# EasyEDA Pro project RESPi.epro

# Schematic Schematic1
Board Name: Board1; Create Date: 2025-11-06; Page Name: P1; Project Name: RESPi; Schematic Name: Schematic1; Update Date: 2025-11-08; Company: EasyEDA.com; Page Size: A4; Version: V1.0
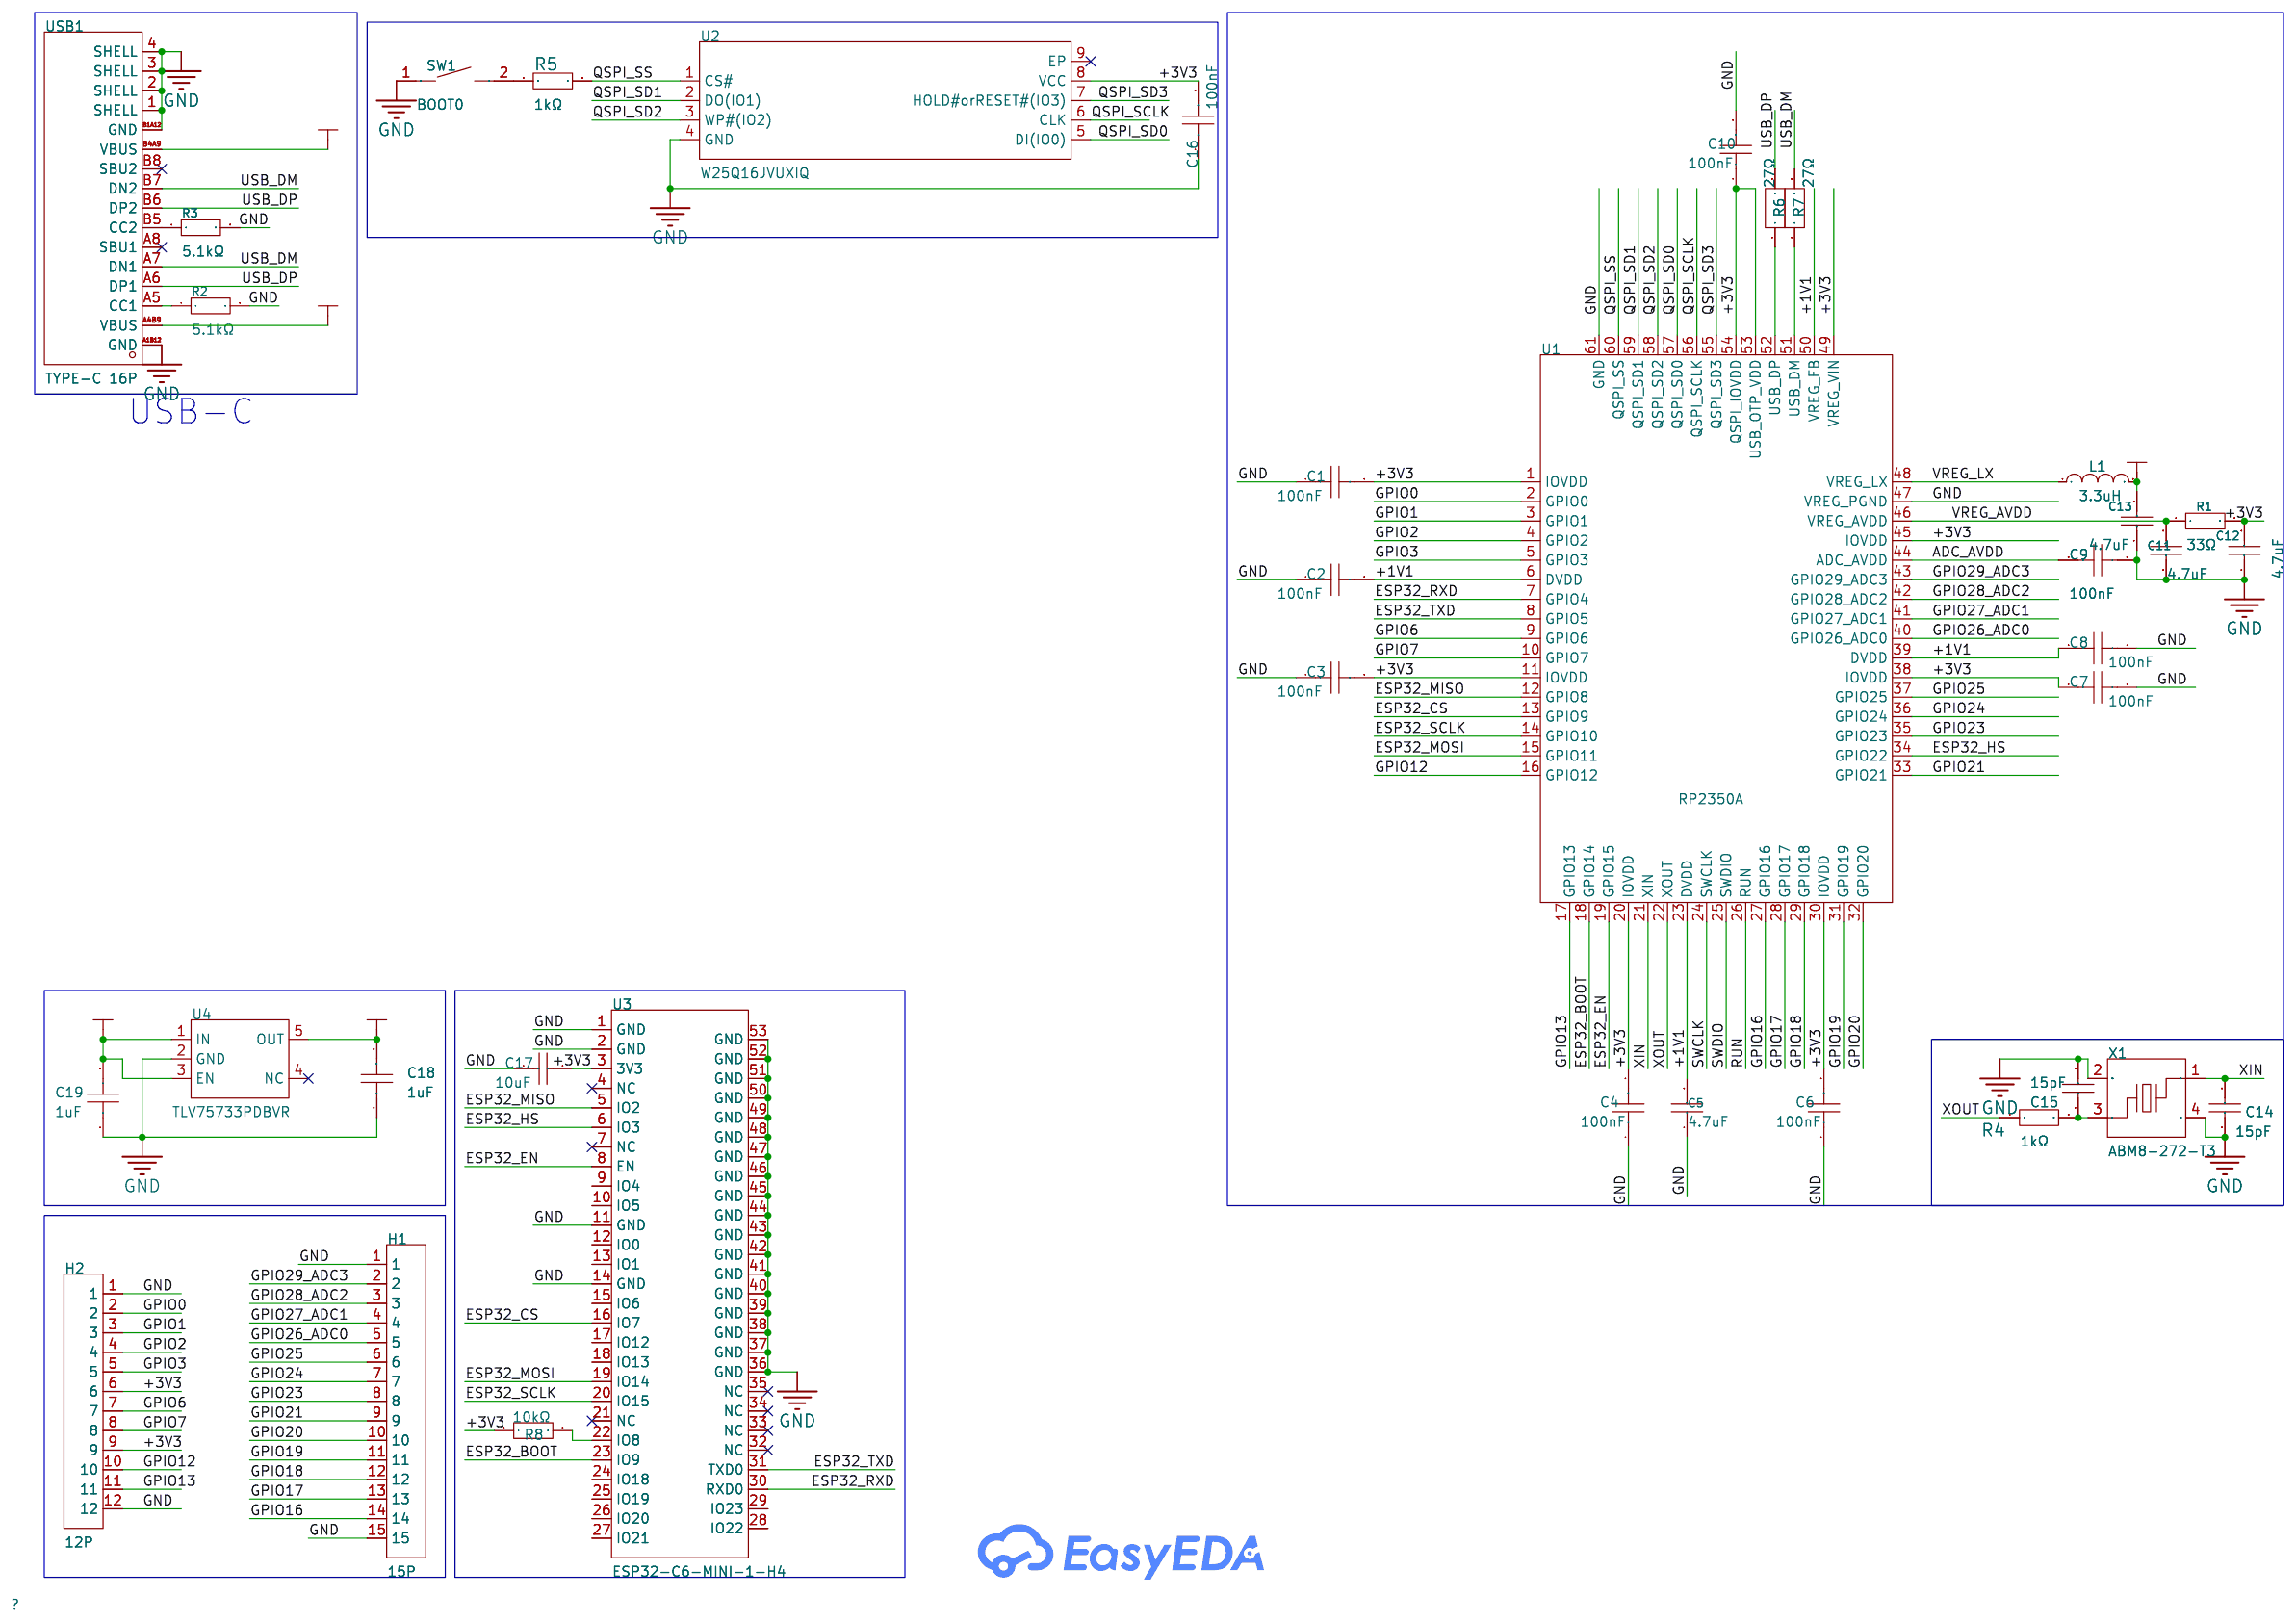
[diagram p0: schematic sheet]

## Parts
C1  100nF  [C0402_custom]
C2  100nF  [C0402_custom]
C3  100nF  [C0402_custom]
C4  100nF  [C0402_custom]
C5  4.7uF  [C0402_custom]
C6  100nF  [C0402_custom]
C7  100nF  [C0402_custom]
C8  100nF  [C0402_custom]
C9  100nF  [C0402_custom]
C10  100nF  [C0402_custom]
C11  4.7uF  [C0402_custom]
C12  4.7uF  [C0402_wider]
C13  4.7uF  [C0402_wider]
C14  15pF  [C0402_custom]
C15  15pF  [C0402_custom]
C16  100nF  [C0402_custom]
C17  10uF  [C0402_custom]
C18  1uF  [C0402_custom]
C19  1uF  [C0402_custom]
H1  15P  [HDR-TH_15P-P2.54-V-M]
H2  12P  [HDR-TH_12P-P2.54-V-M]
L1  3.3uH  [IND-SMD_L2.0-W1.6_AOTA-B201610S3R3-101-T]
R1  33Ω  [R0402]
R2  5.1kΩ  [R0402]
R3  5.1kΩ  [R0402]
R4  1kΩ  [R0402]
R5  1kΩ  [R0402]
R6  27Ω  [R0402]
R7  27Ω  [R0402]
R8  10kΩ  [R0402]
SW1  BOOT0  [SW-SMD_L3.9-W3.0-P4.45]
U1  RP2350A  [QFN-60_L7.0-W7.0-P0.40-TL-EP3.4]
U2  W25Q16JVUXIQ  [USON-8_L3.0-W2.0-P0.50-BL-EP]
U3  ESP32-C6-MINI-1-H4  [WIFIM-SMD_61P-L16.6-W13.2-P0.80-ESP32-C6-MINI-1-N4]
U4  TLV75733PDBVR  [SOT-23-5_L2.9-W1.6-P0.95-LS2.8-BL]
USB1  TYPE-C 16P  [USB-C-SMD_TYPE-C16PIN]
X1  ABM8-272-T3  [CRYSTAL-SMD_4P-L3.2-W2.5-BL]

## Library data of the parts
C1-C4 C6-C10 C16 = CL05B104KO5NNNC: Capacitance: Tolerance:±10% Tolerance:±10% Voltage Rated: Temperature Coefficient:; LCSC Part Name: 100nF ±10% 16V; Supplier Part: C1525; Manufacturer: SAMSUNG(三星); Supplier Footprint: 0402; Datasheet: https://atta.szlcsc.com/upload/public/pdf/source/20160218/1457707763339.pdf; Supplier: LCSC; Tolerance: ±10%
C5 C11-C13 = CL05A475MP5NRNC: Capacitance: Tolerance:±20% Tolerance:±20% Voltage Rated: Temperature Coefficient:; LCSC Part Name: 4.7uF ±20% 10V; Supplier Part: C23733; Manufacturer: SAMSUNG(三星); Supplier Footprint: 0402; JLCPCB Part Class: Basic Part; Datasheet: https://atta.szlcsc.com/upload/public/pdf/source/20160218/1457707763339.pdf; Supplier: LCSC; Tolerance: ±20%
C14 C15 = 0402CG150J500NT: Capacitance: Tolerance:±5% Tolerance:±5% Voltage Rated: Temperature Coefficient:; LCSC Part Name: 15pF ±5% 50V; Supplier Part: C1548; Manufacturer: FH(风华); Supplier Footprint: 0402; JLCPCB Part Class: Basic Part; Datasheet: https://atta.szlcsc.com/upload/public/pdf/source/20200305/C486355_26A10D38EF8C2A5C37091D0039909270.pdf; Supplier: LCSC; Tolerance: ±5%
C17 = CL05A106MQ5NUNC: Capacitance:10uF Tolerance:±20% Tolerance:±20% Voltage Rating:6.3V Temperature Coefficient:X5R; LCSC Part Name: 10uF ±20% 6.3V; Supplier Part: C15525; Manufacturer: SAMSUNG(三星); Supplier Footprint: 0402; JLCPCB Part Class: Basic Part; Datasheet: https://item.szlcsc.com/datasheet/CL05A106MQ5NUNC/16204.html; Supplier: LCSC; Tolerance: ±20%; Voltage Rating: 6.3V; Temperature Coefficient: X5R
C18 C19 = CL05A105KA5NQNC: Capacitance:1uF Tolerance:±10% Tolerance:±10% Voltage Rating:25V Temperature Coefficient:X5R; LCSC Part Name: 1uF ±10% 25V; Supplier Part: C52923; Manufacturer: SAMSUNG(三星); Supplier Footprint: 0402; Datasheet: https://item.szlcsc.com/datasheet/CL05A105KA5NQNC/53938.html; Supplier: LCSC; Tolerance: ±10%; Voltage Rating: 25V; Temperature Coefficient: X5R
H1 = X6511WV-15H-C60D30: Pin Structure:1x15P Pitch:2.54mm Row Spacing:2.54mm Circluar Pins/Square Pins:Policy Number of Rows:Single Row Number of Pins:15P Current Rating:3A Voltage Rating (Max):250V Length of Mating Pin:- Insulation Height:2.5mm Length of End Connection Pin:- Con; LCSC Part Name: 1x15P 间距:2.54mm 方针; Supplier Part: C725947; Manufacturer: XKB Connection(中国星坤); Supplier Footprint: 插件,P=2.54mm; Datasheet: https://atta.szlcsc.com/upload/public/pdf/source/20221108/2FDDF9C694C8EDC81165E23F2EAAE597.pdf; Supplier: LCSC; Pin Structure: 1x15P; Pitch: 2.54mm; Row Spacing: 2.54mm; Circluar Pins/Square Pins: Policy; Number of Rows: Single Row; Current Rating: 3A; Voltage Rating (Max): 250V; Insulation Height: 2.5mm; Contact Material: Brass; Contact Plating: Gold; Operating Temperature: -40℃~+105℃; Color: Black
H2 = X6511WV-12H-C60D30: Pin Structure:1x12P Pitch:2.54mm Row Spacing:2.54mm Circluar Pins/Square Pins:Pin Header Number of Rows:1 Number of Pins:12P Current Rating:3A Voltage Rating (Max):250V Length of Mating Pin:- Insulation Height:2.5mm Length of End Connection Pin:- Contact; LCSC Part Name: 1x12P 间距:2.54mm 方针; Supplier Part: C725944; Manufacturer: XKB Connection(中国星坤); Supplier Footprint: 插件,P=2.54mm; Datasheet: https://item.szlcsc.com/datasheet/X6511WV-12H-C60D30/772393.html; Supplier: LCSC; Pin Structure: 1x12P; Pitch: 2.54mm; Row Spacing: 2.54mm; Circluar Pins/Square Pins: Pin Header; Number of Rows: 1; Current Rating: 3A; Voltage Rating (Max): 250V; Insulation Height: 2.5mm; Contact Material: Brass; Contact Plating: Gold; Operating Temperature: -40℃~+105℃; Color: Black
L1 = AOTA-B201610S3R3-101-T: Supplier Part: C42411119; Manufacturer: ABRACON; Supplier Footprint: 0806; JLCPCB Part Class: Extended Part; Datasheet: https://atta.szlcsc.com/upload/public/pdf/source/20241210/8ED7235334351200B2CE75E3CBC0DAAD.pdf; Supplier: LCSC
R1 = 0402WGF330JTCE: Type:Thick Film Resistors Resistance:33Ω Tolerance:±1% Tolerance:±1% Power(Watts): Overload Voltage (Max): Temperature Coefficient:±100ppm/℃ Temperature Coefficient:±100ppm/℃ Operating Temperature Range:-55℃~+155℃ Operating Temperature Range:-55℃~+155℃; LCSC Part Name: 33Ω ±1% 62.5mW 厚膜电阻; Supplier Part: C25105; Manufacturer: UNI-ROYAL(厚声); Supplier Footprint: 0402; Datasheet: https://atta.szlcsc.com/upload/public/pdf/source/20200306/C422600_1E6D84923E4A46A82E41ADD87F860B5C.pdf; Supplier: LCSC; Type: Thick Film Resistors; Tolerance: ±1%; Temperature Coefficient: ±100ppm/℃; Operating Temperature Range: -55℃~+155℃
R2 R3 = 0402WGF5101TCE: Type:Thick Film Resistor Resistance:5.1kΩ Tolerance:±1% Tolerance:±1% Power(Watts):62.5mW Voltage-Supply(Max):50V Temperature Coefficient:±100ppm/℃ Temperature Coefficient:±100ppm/℃ Operating Temperature:-55℃~+155℃ Operating Temperature:-55℃~+155℃; LCSC Part Name: 5.1kΩ ±1% 62.5mW 厚膜电阻; Supplier Part: C25905; Manufacturer: UNI-ROYAL(厚声); Supplier Footprint: 0402; JLCPCB Part Class: Basic Part; Datasheet: https://atta.szlcsc.com/upload/public/pdf/source/20200306/C422600_1E6D84923E4A46A82E41ADD87F860B5C.pdf; Supplier: LCSC; Type: Thick Film Resistor; Tolerance: ±1%; Power(Watts): 62.5mW; Voltage-Supply(Max): 50V; Temperature Coefficient: ±100ppm/℃; Operating Temperature: -55℃~+155℃
R4 R5 = 0402WGF1001TCE: Type:Thick Film Resistors Resistance:1kΩ Tolerance:±1% Tolerance:±1% Power(Watts): Overload Voltage (Max): Temperature Coefficient:±100ppm/℃ Temperature Coefficient:±100ppm/℃ Operating Temperature Range:-55℃~+155℃ Operating Temperature Range:-55℃~+155℃; LCSC Part Name: 1kΩ ±1% 62.5mW 厚膜电阻; Supplier Part: C11702; Manufacturer: UNI-ROYAL(厚声); Supplier Footprint: 0402; JLCPCB Part Class: Basic Part; Datasheet: https://atta.szlcsc.com/upload/public/pdf/source/20200306/C422600_1E6D84923E4A46A82E41ADD87F860B5C.pdf; Supplier: LCSC; Type: Thick Film Resistors; Tolerance: ±1%; Temperature Coefficient: ±100ppm/℃; Operating Temperature Range: -55℃~+155℃
R6 R7 = WR04X270JTL_C384351: Type:Thick Film Resistor Resistance:27Ω Tolerance:±5% Tolerance:±5% Power(Watts):62.5mW Voltage-Supply(Max):50V Temperature Coefficient:±100ppm/℃ Temperature Coefficient:±100ppm/℃ Operating Temperature:-55℃~+155℃ Operating Temperature:-55℃~+155℃; LCSC Part Name: 厚膜电阻 27Ω ±5% 62.5mW; Supplier Part: C384351; Manufacturer: Walsin(华新科); Manufacturer Part: WR04X270JTL; Supplier Footprint: 0402; JLCPCB Part Class: Extended Part; Datasheet: https://atta.szlcsc.com/upload/public/pdf/source/20191217/C470037_D99261402F77DA8B1D609223749D445A.pdf; Supplier: LCSC; Type: Thick Film Resistor; Tolerance: ±5%; Power(Watts): 62.5mW; Voltage-Supply(Max): 50V; Temperature Coefficient: ±100ppm/℃; Operating Temperature: -55℃~+155℃
R8 = 0402WGF1002TCE: Type:Thick Film Resistor Resistance:10kΩ Tolerance:±1% Tolerance:±1% Power(Watts):62.5mW Voltage-Supply(Max):50V Temperature Coefficient:±100ppm/℃ Temperature Coefficient:±100ppm/℃ Operating Temperature:-55℃~+155℃ Operating Temperature:-55℃~+155℃; LCSC Part Name: 10kΩ ±1% 62.5mW 厚膜电阻; Supplier Part: C25744; Manufacturer: UNI-ROYAL(厚声); Supplier Footprint: 0402; JLCPCB Part Class: Basic Part; Datasheet: https://item.szlcsc.com/datasheet/0402WGF1002TCE/26487.html; Supplier: LCSC; Type: Thick Film Resistor; Tolerance: ±1%; Power(Watts): 62.5mW; Voltage-Supply(Max): 50V; Temperature Coefficient: ±100ppm/℃; Operating Temperature: -55℃~+155℃
SW1 = TS-1088-AR02016: Circuit:SPST Actuator Style:Round Button Operating Force:160gf Mounting Style:Brick nogging Switch Length:4mm Switch Width:3mm Switch Height:2mm Strike Gundam:不带 Contact Current:50mA Voltage Rating (DC):12V Insulation Resistance:100MΩ Actuator/Cap Color:B; LCSC Part Name: 4*3*2mm 立贴 轻触开关; Supplier Part: C720477; Manufacturer: XUNPU(讯普); Supplier Footprint: SMD; Datasheet: https://atta.szlcsc.com/upload/public/pdf/source/20200810/C720475_60D09DD6C54279ADDB2DC25100F1CC11.pdf; Supplier: LCSC; Circuit: SPST; Actuator Style: Round Button; Operating Force: 160gf; Mounting Style: Brick nogging; Switch Length: 4mm; Switch Width: 3mm; Switch Height: 2mm; Strike Gundam: 不带; Contact Current: 50mA; Voltage Rating (DC): 12V; Insulation Resistance: 100MΩ; Actuator/Cap Color: Black; Pin Style: SMDSplicing; Mechanical Life: 10万次; Operating Temperature: -30℃~+80℃
U1 = RP2350A_C42411118: LCSC Part Name: 微控制器; Supplier Part: C42411118; Manufacturer: Raspberry Pi(树莓派); Supplier Footprint: QFN-60-EP(7x7); JLCPCB Part Class: Extended Part; Datasheet: https://item.szlcsc.com/datasheet/RP2350A/44392931.html; Supplier: LCSC
U2 = W25Q16JVUXIQ: Interface:SPI Memory Size:16Mbit Clock Frequency:133MHz Voltage - Supply:2.7V~3.6V Voltage - Supply:2.7V~3.6V Program / Erase Cycles:100,000 Cycles Page Programming Time (Tpp):3ms Data Retention - TDR (Year):20 Years; Supplier Part: C2843335; Manufacturer: Winbond(华邦); Supplier Footprint: USON-8-EP(2x3); Datasheet: https://atta.szlcsc.com/upload/public/pdf/source/20210629/C2843335_FB4D78B5076715625DC0C83F790D3044.pdf; Supplier: LCSC; Interface: SPI; Memory Size: 16Mbit; Clock Frequency: 133MHz; Voltage - Supply: 2.7V~3.6V; Program / Erase Cycles: 100,000 Cycles; Page Programming Time (Tpp): 3ms; Data Retention - TDR (Year): 20 Years
U3 = ESP32-C6-MINI-1-H4: Supplier Part: C6553337; Manufacturer: ESPRESSIF(乐鑫); Supplier Footprint: SMD-53P; JLCPCB Part Class: Extended Part; Datasheet: https://atta.szlcsc.com/upload/public/pdf/source/20240130/4529D418EFEC832950EB8101798FAED6.pdf; Supplier: LCSC
U4 = TLV75733PDBVR: Output Type:Fixed Voltage - Supply:5.5V Output Voltage:3.3V Output Voltage:3.3V Output Current:1A Power Supply Rejection Ratio (PSRR):46dB@(100kHz) Voltage Dropout:650mV@(1A) standby current:40uA Noise:71.5uVrms Features:Under Voltage Lockout；Soft Start；O; LCSC Part Name: 具有使能功能的 1A、低 IQ、高精度、低压降稳压器; Supplier Part: C485517; Manufacturer: TI(德州仪器); Supplier Footprint: SOT-23-5; JLCPCB Part Class: Extended Part; Datasheet: https://www.ti.com/cn/lit/gpn/tlv757p; Supplier: LCSC; Output Type: Fixed; Voltage - Supply: 5.5V; Output Voltage: 3.3V; Output Current: 1A; Power Supply Rejection Ratio (PSRR): 46dB@(100kHz); Voltage Dropout: 650mV@(1A); standby current: 40uA; Noise: 71.5uVrms; Features: Under Voltage Lockout；Soft Start；Over Temperature Protection；Over Current Protection; Operating Temperature: -40℃~+125℃@(Tj); Output Configuration: Positive; Number of Outputs: 1
USB1 = TYPE-C16PIN: Connector Type:Type-C Protocol Standard:USB 3.1 Gender:Female Mounting Type:Surface Mount, Right Angle Number of Contacts:16P Number of Ports:1 Current Rating-Power:3A Voltage Rating:30V Connect-Disconnect Life:10,000 Cycles Detection color:Black Operatin; LCSC Part Name: Type-C 母 卧贴; Supplier Part: C393939; Manufacturer: SHOU HAN(首韩); Supplier Footprint: SMD; JLCPCB Part Class: Extended Part; Datasheet: https://atta.szlcsc.com/upload/public/pdf/source/20250618/9FBF2A26CFCE0E69298FA0B726710E9E.pdf; Supplier: LCSC; Connector Type: Type-C; Protocol Standard: USB 3.1; Gender: Female; Mounting Type: Surface Mount, Right Angle; Number of Contacts: 16P; Number of Ports: 1; Current Rating-Power: 3A; Voltage Rating: 30V; Connect-Disconnect Life: 10,000 Cycles; Detection color: Black; Operating Temperature: -40℃~+85℃
X1 = ABM8-272-T3_C20625731: Supplier Part: C20625731; Manufacturer: ABRACON; Supplier Footprint: SMD3225-4P; JLCPCB Part Class: Extended Part; Datasheet: https://atta.szlcsc.com/upload/public/pdf/source/20240227/A8BE43F636D80F75C9AF5C59EDF21E9A.pdf; Supplier: LCSC

## Nets
+1V1: C2.2 C5.2 C8.2 C13.2 L1.2 U1.6(DVDD) U1.23(DVDD) U1.39(DVDD) U1.50(VREG_FB)
+3V3: C1.2 C3.2 C4.2 C6.2 C7.2 C10.1 C12.2 C16.2 C17.2 C18.2 H2.6 H2.9 R1.2 R8.1 U1.1(IOVDD) U1.11(IOVDD) U1.20(IOVDD) U1.30(IOVDD) U1.38(IOVDD) U1.45(IOVDD) U1.49(VREG_VIN) U1.53(USB_OTP_VDD) U1.54(QSPI_IOVDD) U2.8(VCC) U3.3(3V3) U4.5(OUT)
GND: C1.1 C2.1 C3.1 C4.1 C5.1 C6.1 C7.1 C8.1 C9.1 C10.2 C11.1 C12.1 C13.1 C14.1 C15.2 C16.1 C17.1 C18.1 C19.1 H1.1 H1.15 H2.1 H2.12 R2.2 R3.2 SW1.1 U1.47(VREG_PGND) U1.61(GND) U2.4(GND) U3.1(GND) U3.2(GND) U3.11(GND) U3.14(GND) U3.36(GND) U3.37(GND) U3.38(GND) U3.39(GND) U3.40(GND) U3.41(GND) U3.42(GND) U3.43(GND) U3.44(GND) U3.45(GND) U3.46(GND) U3.47(GND) U3.48(GND) U3.49(GND) U3.50(GND) U3.51(GND) U3.52(GND) U3.53(GND) U4.2(GND) USB1.1(SHELL) USB1.2(SHELL) USB1.3(SHELL) USB1.4(SHELL) USB1.A1B12(GND) USB1.B1A12(GND) X1.2(GND) X1.4(GND)
VBUS: C19.2 U4.1(IN) U4.3(EN) USB1.A4B9(VBUS) USB1.B4A9(VBUS)
ADC_AVDD: C9.2 U1.44(ADC_AVDD)
ESP32_BOOT: U1.18(GPIO14) U3.23(IO9)
ESP32_CS: U1.13(GPIO9) U3.16(IO7)
ESP32_EN: U1.19(GPIO15) U3.8(EN)
ESP32_HS: U1.34(GPIO22) U3.6(IO3)
ESP32_MISO: U1.12(GPIO8) U3.5(IO2)
ESP32_MOSI: U1.15(GPIO11) U3.19(IO14)
ESP32_RXD: U1.7(GPIO4) U3.30(RXD0)
ESP32_SCLK: U1.14(GPIO10) U3.20(IO15)
ESP32_TXD: U1.8(GPIO5) U3.31(TXD0)
GPIO0: H2.2 U1.2(GPIO0)
GPIO1: H2.3 U1.3(GPIO1)
GPIO2: H2.4 U1.4(GPIO2)
GPIO3: H2.5 U1.5(GPIO3)
GPIO6: H2.7 U1.9(GPIO6)
GPIO7: H2.8 U1.10(GPIO7)
GPIO12: H2.10 U1.16(GPIO12)
GPIO13: H2.11 U1.17(GPIO13)
GPIO16: H1.14 U1.27(GPIO16)
GPIO17: H1.13 U1.28(GPIO17)
GPIO18: H1.12 U1.29(GPIO18)
GPIO19: H1.11 U1.31(GPIO19)
GPIO20: H1.10 U1.32(GPIO20)
GPIO21: H1.9 U1.33(GPIO21)
GPIO23: H1.8 U1.35(GPIO23)
GPIO24: H1.7 U1.36(GPIO24)
GPIO25: H1.6 U1.37(GPIO25)
GPIO26_ADC0: H1.5 U1.40(GPIO26_ADC0)
GPIO27_ADC1: H1.4 U1.41(GPIO27_ADC1)
GPIO28_ADC2: H1.3 U1.42(GPIO28_ADC2)
GPIO29_ADC3: H1.2 U1.43(GPIO29_ADC3)
QSPI_SCLK: U1.56(QSPI_SCLK) U2.6(CLK)
QSPI_SD0: U1.57(QSPI_SD0) U2.5(DI(IO0))
QSPI_SD1: U1.59(QSPI_SD1) U2.2(DO(IO1))
QSPI_SD2: U1.58(QSPI_SD2) U2.3(WP#(IO2))
QSPI_SD3: U1.55(QSPI_SD3) U2.7(HOLD#orRESET#(IO3))
QSPI_SS: R5.2 U1.60(QSPI_SS) U2.1(CS#)
RUN: U1.26(RUN)
SWCLK: U1.24(SWCLK)
SWDIO: U1.25(SWDIO)
USB_DM: R7.2 USB1.A7(DN1) USB1.B7(DN2)
USB_DP: R6.2 USB1.A6(DP1) USB1.B6(DP2)
VREG_AVDD: C11.2 R1.1 U1.46(VREG_AVDD)
VREG_LX: L1.1 U1.48(VREG_LX)
XIN: C14.2 U1.21(XIN) X1.1
XOUT: R4.1 U1.22(XOUT)
$1N315: R7.1 U1.51(USB_DM)
$1N316: R6.1 U1.52(USB_DP)
$1N1363: C15.1 R4.2 X1.3
$1N1601: R3.1 USB1.B5(CC2)
$1N1602: R2.1 USB1.A5(CC1)
$1N1834: R5.1 SW1.2
$1N3549: R8.2 U3.22(IO8)

Not connected (* = marked no-connect by the designer): U2 9(EP)*; U3 4(NC)* 7(NC)* 9(IO4) 10(IO5) 12(IO0) 13(IO1) 15(IO6) 17(IO12) 18(IO13) 21(NC)* 24(IO18) 25(IO19) 26(IO20) 27(IO21) 28(IO22) 29(IO23) 32(NC)* 33(NC)* 34(NC)* 35(NC)*; U4 4(NC)*; USB1 A8(SBU1)* B8(SBU2)*

## Notes on the sheet
- USB-C

# Board PCB1
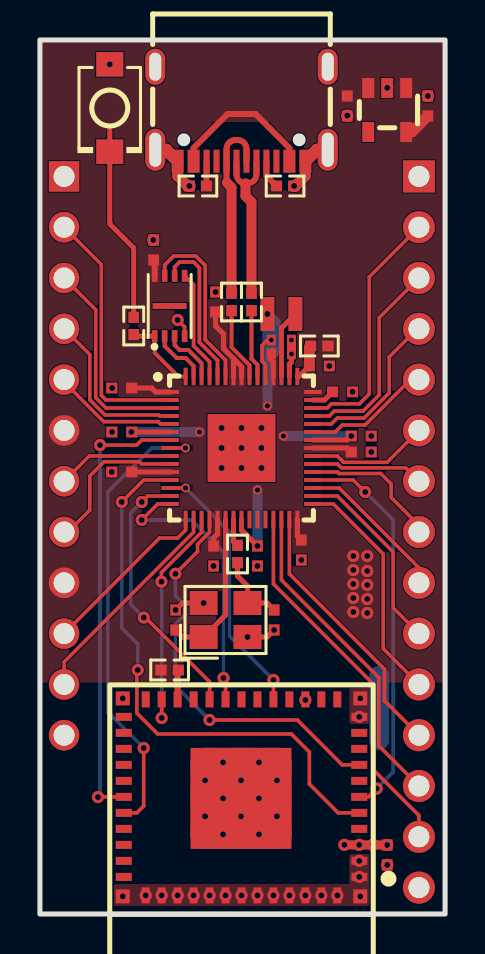
[diagram p1: board, top side]
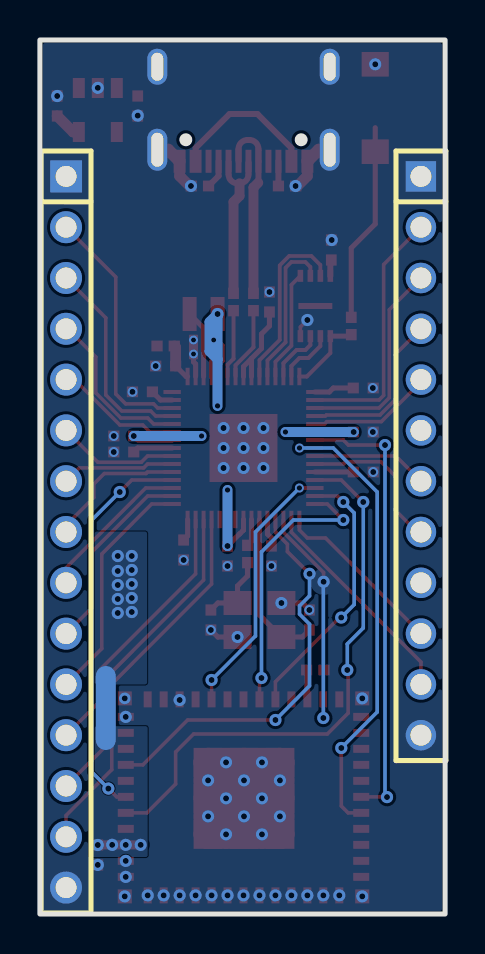
[diagram p2: board, bottom side, seen from below]

Outline 20.3 x 43.7 mm; copper layers: Top Layer, Bottom Layer. Coordinates in mm from the lower left corner of the outline.
Outline path: rectangle 0,43.7 20.3,0
Stack: Top Layer 0.035mm / Dielectric1 1.51mm FR4 er 4.5 / Bottom Layer 0.035mm

## Design rules (mm)
template: Custom Config
spacing copperThickness1oz (default): track to track 0.102, other pairs 0.152 to 0.3
spacing copperThickness2oz: track to track 0.203, other pairs 0.152 to 0.3
track width copperThickness1oz (default): min 0.127, default 0.18, max 2.54
track width copperThickness2oz: min 0.203, default 0.254, max 2.54
differential pair differentialPair (default): width min 0.127, default 0.254, max 2.54; gap min 0.152, default 0.152
via viaSize (default): diameter min 0.4, default 0.61, max 10; hole min 0.2, default 0.3, max 6.3

## Placement (name value [footprint] x y rotation side)
C1  100nF  [C0402_custom]  4.1 26.3 0 top
C2  100nF  [C0402_custom]  4.1 24.1 0 top
C3  100nF  [C0402_custom]  4.1 22.1 0 top
C4  100nF  [C0402_custom]  8.7 17.9 90 top
C5  4.7uF  [C0402_custom]  10.9 17.9 90 top
C6  100nF  [C0402_custom]  13.1 18.2 90 top
C7  100nF  [C0402_custom]  16.1 23.1 180 top
C8  100nF  [C0402_custom]  16.1 23.9 180 top
C9  100nF  [C0402_custom]  15.16 26.11 180 top
C10  100nF  [C0402_custom]  8.8 30.6 90 top
C11  4.7uF  [C0402_custom]  14 27.4 180 top
C12  4.7uF  [C0402_wider]  12.1 28 180 top
C13  4.7uF  [C0402_wider]  12.1 28.7 180 top
C14  15pF  [C0402_custom]  6.8 14.7 270 top
C15  15pF  [C0402_custom]  11.73 14.7 270 top
C16  100nF  [C0402_custom]  5.7 33.2 270 top
C17  10uF  [C0402_custom]  17.4 2.95 90 top
C18  1uF  [C0402_custom]  19.44 40.4 270 top
C19  1uF  [C0402_custom]  15.4 40.4 90 top
H1  15P  [HDR-TH_15P-P2.54-V-M]  18.99 19.1 270 bottom
H2  12P  [HDR-TH_12P-P2.54-V-M]  1.21 22.91 270 bottom
L1  3.3uH  [IND-SMD_L2.0-W1.6_AOTA-B201610S3R3-101-T]  12.1 30 180 top
R1  33Ω  [R0402]  14 28.4 0 top
R2  5.1kΩ  [R0402]  12.28 36.4 0 top
R3  5.1kΩ  [R0402]  7.92 36.4 180 top
R4  1kΩ  [R0402]  9.9 18 270 top
R5  1kΩ  [R0402]  4.7 29.4 270 top
R6  27Ω  [R0402]  9.6 30.6 90 top
R7  27Ω  [R0402]  10.6 30.6 90 top
R8  10kΩ  [R0402]  6.5 12.2 0 top
SW1  BOOT0  [SW-SMD_L3.9-W3.0-P4.45]  3.5 40.3 270 top
U1  RP2350A  [QFN-60_L7.0-W7.0-P0.40-TL-EP3.4]  10.1 23.3 0 top
U2  W25Q16JVUXIQ  [USON-8_L3.0-W2.0-P0.50-BL-EP]  6.5 30.4 0 top
U3  ESP32-C6-MINI-1-H4  [WIFIM-SMD_61P-L16.6-W13.2-P0.80-ESP32-C6-MINI-1-N4]  10.1 5.83 180 top
U4  TLV75733PDBVR  [SOT-23-5_L2.9-W1.6-P0.95-LS2.8-BL]  17.4 40.2 180 top
USB1  TYPE-C 16P  [USB-C-SMD_TYPE-C16PIN]  10.1 40 180 top
X1  ABM8-272-T3  [CRYSTAL-SMD_4P-L3.2-W2.5-BL]  9.3 14.7 0 top

## Footprints (pads in the part's own frame, mm; a bottom-side part is the same pattern mirrored in y, then rotated)
C0402_custom
  rect 0.56x0.54 smd: 1(-0.5,0) 2(0.5,0)
C0402_wider
  rrect 0.45x0.53 smd: 1(-0.505,0) 2(0.505,0)
CRYSTAL-SMD_4P-L3.2-W2.5-BL
  rect 1.4x1.2 smd: 1(-1.1,-0.85) 2(1.1,-0.85) 3(1.1,0.85) 4(-1.1,0.85)
HDR-TH_12P-P2.54-V-M
  rect 1.524x1.524 hole 1.05: 1(-13.97,0)
  round 1.524 hole 1.05: 2(-11.43,0) 3(-8.89,0) 4(-6.35,0) 5(-3.81,0) 6(-1.27,0) 7(1.27,0) 8(3.81,0) 9(6.35,0) 10(8.89,0) 11(11.43,0) 12(13.97,0)
HDR-TH_15P-P2.54-V-M
  rect 1.6x1.6 hole 1.05: 1(-17.78,0)
  round 1.6 hole 1.05: 2(-15.24,0) 3(-12.7,0) 4(-10.16,0) 5(-7.62,0) 6(-5.08,0) 7(-2.54,0) 8(0,0) 9(2.54,0) 10(5.08,0) 11(7.62,0) 12(10.16,0) 13(12.7,0) 14(15.24,0) 15(17.78,0)
IND-SMD_L2.0-W1.6_AOTA-B201610S3R3-101-T
  rect 0.7x1.7 smd: 1(-0.7,0) 2(0.7,0)
QFN-60_L7.0-W7.0-P0.40-TL-EP3.4
  rect 0.875x0.2 smd: 1(-3.575,2.8) 2(-3.575,2.4) 3(-3.575,2) 4(-3.575,1.6) 5(-3.575,1.2) 6(-3.575,0.8) 7(-3.575,0.4) 8(-3.575,0) 9(-3.575,-0.4) 10(-3.575,-0.8) 11(-3.575,-1.2) 12(-3.575,-1.6) 13(-3.575,-2) 14(-3.575,-2.4) 15(-3.575,-2.8) 31(3.575,-2.8) 32(3.575,-2.4) 33(3.575,-2.001) 34(3.575,-1.6) 35(3.575,-1.2) 36(3.575,-0.8) 37(3.575,-0.4) 38(3.575,-0.001) 39(3.575,0.4) 40(3.575,0.8) 41(3.575,1.2) 42(3.575,1.6) 43(3.575,2) 44(3.575,2.4) 45(3.575,2.8)
  rect 0.2x0.875 smd: 16(-2.8,-3.575) 17(-2.4,-3.575) 18(-2,-3.575) 19(-1.6,-3.575) 20(-1.2,-3.575) 21(-0.8,-3.575) 22(-0.4,-3.575) 23(0,-3.575) 24(0.4,-3.575) 25(0.8,-3.575) 26(1.2,-3.575) 27(1.6,-3.575) 28(2,-3.575) 29(2.4,-3.575) 30(2.8,-3.575) 46(2.8,3.575) 47(2.4,3.575) 48(2,3.575) 49(1.6,3.575) 50(1.2,3.575) 51(0.8,3.575) 52(0.4,3.575) 53(0,3.575) 54(-0.4,3.575) 55(-0.8,3.575) 56(-1.2,3.575) 57(-1.6,3.575) 58(-2,3.575) 59(-2.4,3.575) 60(-2.8,3.575)
  rect 3.4x3.4 smd: 61(0,0)
R0402
  rect 0.566x0.54 smd: 1(-0.433,0) 2(0.433,0)
SOT-23-5_L2.9-W1.6-P0.95-LS2.8-BL
  rect 0.6x1 smd: 1(-0.95,-1.1) 2(0,-1.1) 3(0.95,-1.1) 4(0.95,1.1) 5(-0.95,1.1)
SW-SMD_L3.9-W3.0-P4.45
  rect 1.23x1.36 smd: 1(-2.185,0) 2(2.185,0)
USB-C-SMD_TYPE-C16PIN
  oval 1x2.1 hole 0.6x1.7: 1(-4.32,1.788) 2(4.32,1.788)
  oval 1x1.8 hole 0.6x1.4: 3(-4.32,-2.362) 4(4.32,-2.362)
  rect 0.6x1.15 smd: A1B12(-3.2,2.362) A4B9(-2.4,2.362) B1A12(3.2,2.362) B4A9(2.4,2.362)
  rect 0.3x1.15 smd: A5(-1.25,2.362) A6(-0.25,2.362) A7(0.25,2.362) A8(1.25,2.362) B5(1.75,2.362) B6(0.75,2.362) B7(-0.75,2.362) B8(-1.75,2.362)
USON-8_L3.0-W2.0-P0.50-BL-EP
  rect 0.28x0.6 smd: 1(-0.75,-1.508) 2(-0.25,-1.508) 3(0.25,-1.508) 4(0.75,-1.508) 5(0.75,1.508) 6(0.25,1.508) 7(-0.25,1.508) 8(-0.75,1.508)
  rect 1.7x0.3 smd: 9(0,0)
WIFIM-SMD_61P-L16.6-W13.2-P0.80-ESP32-C6-MINI-1-N4
  rect 0.8x0.4 smd: 1(-5.9,3.975) 2(-5.9,3.175) 3(-5.9,2.375) 4(-5.9,1.575) 5(-5.9,0.775) 6(-5.9,-0.025) 7(-5.9,-0.825) 8(-5.9,-1.625) 9(-5.9,-2.425) 10(-5.9,-3.225) 11(-5.9,-4.025) 25(5.9,-4.025) 26(5.9,-3.225) 27(5.9,-2.425) 28(5.9,-1.625) 29(5.9,-0.825) 30(5.9,-0.025) 31(5.9,0.775) 32(5.9,1.575) 33(5.9,2.375) 34(5.9,3.175) 35(5.9,3.975)
  rect 0.4x0.8 smd: 12(-4.8,-4.9) 13(-4,-4.9) 14(-3.2,-4.9) 15(-2.4,-4.9) 16(-1.6,-4.9) 17(-0.8,-4.9) 18(0,-4.9) 19(0.8,-4.9) 20(1.6,-4.9) 21(2.4,-4.9) 22(3.2,-4.9) 23(4,-4.9) 24(4.8,-4.9) 36(4.8,4.9) 37(4,4.9) 38(3.2,4.9) 39(2.4,4.9) 40(1.6,4.9) 41(0.8,4.9) 42(0,4.9) 43(-0.8,4.9) 44(-1.6,4.9) 45(-2.4,4.9) 46(-3.2,4.9) 47(-4,4.9) 48(-4.8,4.9)
  rect 1.45x1.45 smd: 49(-1.775,1.85) 49(-1.775,0.05) 49(-1.775,-1.75) 49(0.025,1.85) 49(0.025,0.05) 49(0.025,-1.75) 49(1.825,1.85) 49(1.825,0.05) 49(1.825,-1.75)
  rect 0.7x0.7 smd: 50(5.95,4.95) 51(5.95,-4.95) 52(-5.95,-4.95) 53(-5.95,4.95)

## Nets
As in the schematic.

Pads without a net: U2 9; U3 4 7 9 10 12 13 15 17 18 21 24 25 26 27 28 29 32 33 34 35; U4 4; USB1 A8 B8

## Via types
v1: diameter 0.61, hole 0.3, Top Layer to Bottom Layer, 74 vias
v2: diameter 0.45, hole 0.25, Top Layer to Bottom Layer, 3 vias
v3: diameter 0.61, hole 0.305, Top Layer to Bottom Layer, 9 vias
v4: diameter 0.5, hole 0.3, Top Layer to Bottom Layer, 16 vias
v5: diameter 0.58, hole 0.3, Top Layer to Bottom Layer, 1 via
v6: diameter 0.45, hole 0.27, Top Layer to Bottom Layer, 6 vias

## Routing (per net, layer and track width the routed paths; a pad name or vN(x,y) marks a point on that pad's centre or on a via; arc(x,y) is an arc through that point)
+1V1: length 24.6
  Top Layer w0.18: U1.50 11.3,27.48 11.13,27.65 11.13,28.43 11.4,28.7 v2(11.59,28.7)
  Top Layer w0.254: U1.39 15.4,23.7 v4(15.6,23.9) ; v4(10.9,18.4) 10.29,19.01 10.28,19.01 10.12,19.17 10.12,19.18 10.1,19.2 U1.23 ; U1.6 C2.2
  Bottom Layer w0.5: v6(10.9,21.2) v4(10.9,18.4) ; v6(11.4,25.4) 11.4,27.74 ; 11.4,27.74 11.8,28.14 11.8,29.6 v1(11.4,30) 11.4,27.74 ; v6(8,24.1) v4(4.58,24.1) ; v6(12.2,23.9) v4(15.6,23.9)
+3V3: length 21.9
  Top Layer w0.254: C1.2 5.6,26.3 5.8,26.1 U1.1 ; U1.49 11.7,27.6 11.59,27.7 C12.2 ; U1.54 9.7,27.77 ; 9.7,27.77 9.2,28.27 9.2,29 8.8,29.4 C10.1 ; 9.7,27.77 10.1,27.37 U1.53 ; C4.2 8.7,18.8 8.9,19 U1.20 ; C6.2 12.9,18.9 U1.30 ; U1.38 15.4,23.3 C7.2 ; U1.11 C3.2
  Top Layer w0.3: U2.8 5.75,32.65 C16.2
  Top Layer w0.45: v1(17.4,3.45) 17.39,3.46 v1(16.68,3.46) v1(16,3.46) v1(15.25,3.46)
  Top Layer w0.54: C18.2 18.63,39.1 U4.5
  Bottom Layer w1: 17,8.7 17,11.9
  vias: v1(15.7,17.9) v1(15.7,17.2) v1(15.7,16.5) v1(15.7,15.8) v1(15.7,15.1) v1(16.4,17.9) v1(16.4,17.15) v1(16.4,16.45) v1(16.4,15.75) v1(16.4,15.05)
GND: length 36.2
  Top Layer w0.18: v1(6.9,29.7) 7.25,29.35 U2.4
  Top Layer w0.254: v4(11.73,14.2) 11.38,13.85 v1(10.4,13.85) ; v1(8.2,15.55) 7.15,15.55 v4(6.8,15.2) ; v2(12.6,28) 12.6,27.61 12.5,27.5 U1.47 ; U3.14 v1(13.3,10.7)
  Top Layer w0.45: v2(12.6,28.7) v2(12.6,28)
  Top Layer w0.54: v1(12.73,36.4) 12.8,36.4 13.3,36.9 USB1.A1B12 ; R3.2 7.4,36.4 6.9,36.9 USB1.B1A12
  Top Layer w0.6: USB1.2 6.32,38.21 USB1.B1A12 ; USB1.1 13.88,38.21 USB1.A1B12
  Top Layer w1.45: 8.28,3.98 v1(9.17,3.98) v1(10.97,3.98) 11.88,3.98 ; 8.28,3.98 v1(8.28,4.88) v1(8.28,6.68) U3.49 ; 8.28,3.98 10.07,5.78 ; U3.49 v1(9.17,7.58) U3.49 v1(10.97,7.58) U3.49 ; U3.49 10.07,5.78 ; 11.88,3.98 v1(11.88,4.88) v1(11.88,6.68) U3.49 ; 11.88,3.98 10.07,5.78 ; 10.07,5.78 U3.49
  vias: v1(3.5,42.48) v1(4.15,10.78) v1(4.15,0.88) v1(5.3,0.93) v1(5.68,33.7) v1(6.1,0.93) v1(6.9,0.93) v1(7.49,36.4) v1(7.7,0.93) v1(8.5,0.93) v1(9.17,5.78) v1(9.3,0.93) v1(10.07,6.68) v1(10.07,4.88) v1(10.1,0.93) v1(10.9,0.93) v1(10.97,5.78) v1(11.7,0.93) v1(12.5,0.93) v1(13.3,0.93) v1(14.1,0.93) v1(14.9,0.93) v1(15.4,39.92) v1(16,9.86) v1(16,2.66) v1(16,1.86) v1(16.05,0.88) v1(17.4,41.31) v1(17.4,2.45) v1(19.44,40.9) v3(9.1,24.3) v3(9.1,23.3) v3(9.1,22.3) v3(10.1,24.3) v3(10.1,23.3) v3(10.1,22.3) v3(11.1,24.3) v3(11.1,23.3) v3(11.1,22.3) v4(3.62,26.3) v4(3.62,24.1) v4(3.6,22.1) v4(8.7,17.4) v4(8.8,31.1) v4(10.9,17.4) v4(13.1,17.7) v4(14.5,27.4) v4(15.66,26.11) v4(16.6,23.9) v4(16.6,23.1) v5(16.05,10.78)
VBUS: length 7.5
  Top Layer w0.3: USB1.B4A9 7.7,38.3 9.4,40 10.8,40 12.5,38.3 USB1.A4B9
ADC_AVDD: length 1.2
  Top Layer w0.254: U1.44 14.26,25.7 C9.2
ESP32_BOOT: length 11.7
  Top Layer w0.18: U1.18 8.1,19.09 6.09,17.08 v1(6.09,16.61) ; U3.23 v1(6.1,9.8)
  Bottom Layer w0.18: v1(6.09,16.61) 6.1,16.6 v1(6.1,9.8)
ESP32_CS: length 13.3
  Top Layer w0.18: v1(11.7,11.7) 11.7,10.63
  Top Layer w0.2: U1.13 v6(7.3,21.3)
  Bottom Layer w0.18: v6(7.3,21.3) 9.5,19.1 9.5,13.9 v1(11.7,11.7)
ESP32_EN: length 20.3
  Top Layer w0.18: v1(8.5,9.7) 12.9,9.7 15.14,7.46 U3.8 ; v1(6.79,17.01) 7.9,18.12 7.9,18.49 8.5,19.09 U1.19
  Bottom Layer w0.18: v1(8.5,9.7) 6.79,11.41 6.79,14.5 7.29,15 7.29,15.4 6.79,15.9 v1(6.79,17.01)
ESP32_HS: length 19.9
  Top Layer w0.18: v1(16.87,6.27) 16.46,5.86 15.9,5.86 16,5.76 ; U1.34 15.7,21.7 v1(16.3,21.1)
  Bottom Layer w0.18: v1(16.3,21.1) 17.7,19.7 17.7,7.1 v1(16.87,6.27)
ESP32_MISO: length 27.9
  Top Layer w0.18: U1.12 5.2,21.7 v1(4.1,20.6) ; v1(4.9,12.2) 4.86,12.16 4.86,10.04 5.9,9 12.6,9 13.5,8.1 13.5,6.5 14.94,5.06 U3.5
  Bottom Layer w0.18: v1(4.1,20.6) 4.1,14.3 4.9,13.5 v1(4.9,12.2)
ESP32_MOSI: length 13.9
  Top Layer w0.18: v1(9.2,11.8) 9.3,11.7 U3.19 ; v1(5.1,19.7) 5.9,20.5 U1.15
  Bottom Layer w0.18: v1(5.1,19.7) 7.6,19.7 9.2,18.1 v1(9.2,11.8)
ESP32_RXD: length 22.6
  Top Layer w0.18: v1(2.91,5.85) 2.92,5.86 U3.30 ; U1.7 5.1,23.7 4.85,23.45 v1(3.01,23.45)
  Bottom Layer w0.18: v1(2.91,5.85) 3.01,5.95 v1(3.01,23.45)
ESP32_SCLK: length 13.3
  Top Layer w0.18: v1(5.2,14.82) 5.28,14.82 8.5,11.61 U3.20 ; U1.14 5.4,20.9 v1(5.1,20.6)
  Bottom Layer w0.18: v1(5.1,20.6) 4.55,20.05 4.55,15.47 v1(5.2,14.82)
ESP32_TXD: length 23.2
  Top Layer w0.18: U3.31 4.86,5.06 5.2,5.4 v1(5.2,8.3) ; U1.8 v6(7.3,23.3)
  Bottom Layer w0.18: v1(5.2,8.3) 3.4,10.1 3.4,21.1 5.6,23.3 v6(7.3,23.3)
GPIO0: length 12.7
  Top Layer w0.18: U1.2 3.31,25.7 3.08,25.93 3.08,32.47 H2.2
GPIO1: length 10.6
  Top Layer w0.18: U1.3 3.31,25.3 2.8,25.81 2.8,30.21 H2.3
GPIO2: length 8.4
  Top Layer w0.18: U1.4 6,24.9 5.95,24.95 3.26,24.95 2.5,25.71 2.5,27.97 H2.4
GPIO3: length 6.3
  Top Layer w0.18: U1.5 6.04,24.5 5.93,24.62 3.19,24.62 1.21,26.6 H2.5
GPIO6: length 5.8
  Top Layer w0.18: U1.9 2.47,22.9 H2.7
GPIO7: length 7.8
  Top Layer w0.18: H2.8 1.4,19.1 2.5,20.2 2.5,21.9 3.21,22.61 4.98,22.61 5.09,22.5 U1.10
GPIO12: length 8.8
  Top Layer w0.18: U1.16 7.3,19.2 6.9,18.8 5.99,18.8 H2.10
GPIO13: length 10.9
  Top Layer w0.18: U1.17 7.7,19.09 1.21,12.6 H2.11
GPIO16: length 18.9
  Top Layer w0.18: U1.27 11.7,16.5 16.7,11.5 16.7,7.22 18.99,4.93 H1.14
GPIO17: length 16.2
  Top Layer w0.18: U1.28 12.1,16.7 16.98,11.82 16.98,8.41 H1.13
GPIO18: length 13.5
  Top Layer w0.18: H1.12 17.26,10.67 17.26,12.24 12.5,17.01 U1.29
GPIO19: length 11.8
  Top Layer w0.18: H1.11 17.2,13.27 17.2,18 14.7,20.5 U1.31
GPIO20: length 9.8
  Top Layer w0.18: U1.32 14.9,20.9 17.7,18.1 17.7,15.31 H1.10
GPIO21: length 7.7
  Top Layer w0.18: U1.33 15,21.3 18.99,17.31 H1.9
GPIO23: length 7.1
  Top Layer w0.18: H1.8 18.99,19.43 17.6,20.82 17.6,21.5 17.08,22.02 14.99,22.02 14.91,22.1 U1.35
GPIO24: length 5.7
  Top Layer w0.18: H1.7 18.32,22.31 15.1,22.31 14.91,22.5 U1.36
GPIO25: length 6.1
  Top Layer w0.18: U1.37 14.91,22.9 15.22,22.59 17.4,22.59 H1.6
GPIO26_ADC0: length 6.4
  Top Layer w0.18: U1.40 14.8,24.1 15.15,24.45 16.29,24.45 18.56,26.72 H1.5
GPIO27_ADC1: length 8.3
  Top Layer w0.18: U1.41 14.6,24.5 14.9,24.8 16.25,24.8 17.5,26.05 17.5,27.85 18.91,29.26 H1.4
GPIO28_ADC2: length 10.4
  Top Layer w0.18: H1.3 17,29.81 17,25.95 16.19,25.15 14.75,25.15 14.5,24.9 U1.42
GPIO29_ADC3: length 12.5
  Top Layer w0.18: H1.2 16.5,31.85 16.5,26 16.01,25.51 14.61,25.51 14.4,25.3 U1.43
QSPI_SCLK: length 7.7
  Top Layer w0.19: U1.56 8.9,27.68 7.99,28.59 7.99,32.31 7.7,32.6 7,32.6 6.75,32.35 U2.6
QSPI_SD0: length 5.6
  Top Layer w0.19: U1.57 8.5,27.61 7.7,28.41 7.7,31.46 U2.5
QSPI_SD1: length 2.9
  Top Layer w0.2: U1.59 7.7,27.4 7.3,27.8 6.85,27.8 6.25,28.4 U2.2
QSPI_SD2: length 2.8
  Top Layer w0.2: U2.3 6.75,28.45 7,28.2 7.44,28.2 8.1,27.54 U1.58
QSPI_SD3: length 8.9
  Top Layer w0.19: U1.55 9.3,27.69 8.28,28.71 8.28,32.43 7.81,32.9 6.7,32.9 6.25,32.45 U2.7
QSPI_SS: length 4
  Top Layer w0.2: U1.60 6.92,26.88 5.75,28.05 U2.1
  Top Layer w0.254: 4.7,28.97 4.77,28.89 U2.1
USB_DM: length 8.4
  Top Layer w0.3: 10.85,37.59 10.85,36.98 arc(10.72,36.66) 10.4,36.53 10.3,36.53 arc(9.98,36.66) 9.85,36.98 9.85,37.59
  Top Layer w0.5: 10.3,36.53 10.3,35.9 10.6,35.6 R7.2
USB_DP: length 9.4
  Top Layer w0.3: 9.35,36.58 USB1.B6 9.35,38.25 arc(9.48,38.57) 9.8,38.7 9.9,38.7 arc(10.22,38.57) 10.35,38.25 USB1.A6
  Top Layer w0.5: 9.36,36.56 9.6,36.33 R6.2
VREG_AVDD: length 1.8
  Top Layer w0.254: U1.46 12.97,26.88 C11.2
  Top Layer w0.54: C11.2 13.5,28.33 R1.1
VREG_LX: length 3.4
  Top Layer w0.254: L1.1 12.1,29.3 U1.48
XIN: length 7.9
  Top Layer w0.254: C14.2 7.15,13.85 X1.1 9.3,14.95 U1.21
XOUT: length 1.4
  Top Layer w0.254: U1.22 9.7,18.63 9.9,18.43
$1N315: length 3.4
  Top Layer w0.2: U1.51 10.9,27.46 10.6,27.76 10.6,30.17
$1N316: length 3.7
  Top Layer w0.2: U1.52 10.5,27.44 9.6,28.34 9.6,30.17
$1N1363: length 3.7
  Top Layer w0.254: R4.2 9.9,16.9 10.4,16.4 X1.3 11.38,15.55 C15.1
$1N1601: length 1.2
  Top Layer w0.3: R3.1 USB1.B5
$1N1602: length 1.4
  Top Layer w0.3: USB1.A5 11.35,36.9 R2.1
$1N1834: length 10
  Top Layer w0.254: 3.5,39.31 3.5,34.5 4.7,33.3 R5.1
$1N3549: length 1.5
  Top Layer w0.3: U3.22 6.9,12.17 R8.2

## Copper pours and planes (outline as drawn; the poured copper is in the pictures)
+1V1 on Top Layer: 7.75,25.65 12.45,25.65 12.45,20.95 7.75,20.95
+3V3 on Top Layer: -0.05,43.77 20.25,43.77 20.25,11.67 -0.05,11.67
+3V3 on Bottom Layer: 15,9.29 17.74,9.29 17.74,2.95 15,2.95
+3V3 on Bottom Layer: 15.03,19.02 17.77,19.02 17.77,11.58 15.03,11.58
GND on Top Layer: 15.6,2.9 16.4,2.9 16.4,0.5 15.6,0.5
GND on Top Layer: 15.6,11.2 16.4,11.2 16.4,9.6 15.6,9.6
GND on Top Layer: 3.8,1.4 16.4,1.4 16.4,0.5 3.8,0.5
GND on Bottom Layer: 0,43.7 20.3,43.7 20.3,0 0,0
VBUS on Top Layer: 7.2,43.1 18.7,43.1 18.7,39.7 7.2,39.7
